# EAGLE design Main (EAGLE 7.2.0)
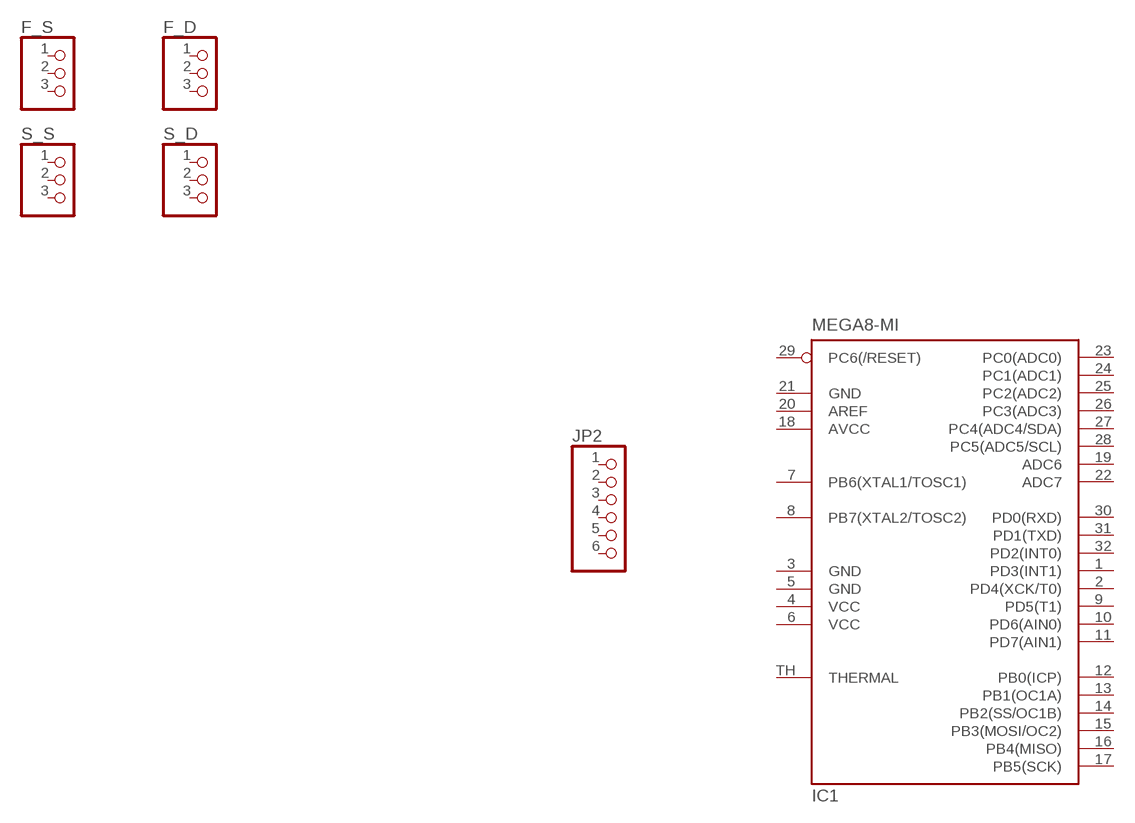
[diagram p0: schematic, sheet 1]

## Parts
F_D  PINHD-1X3  [1X03]
F_S  PINHD-1X3  [1X03]
IC1  MEGA8-MI  [MLF32-TH]
JP2  PINHD-1X6  [1X06]
S_D  PINHD-1X3  [1X03]
S_S  PINHD-1X3  [1X03]
Unconnected: F_D.1 F_D.2 F_D.3 F_S.1 F_S.2 F_S.3 IC1.1(PD3(INT1)) IC1.2(PD4(XCK/T0)) IC1.7(PB6(XTAL1/TOSC1)) IC1.8(PB7(XTAL2/TOSC2)) IC1.9(PD5(T1)) IC1.10(PD6(AIN0)) IC1.11(PD7(AIN1)) IC1.12(PB0(ICP)) IC1.13(PB1(OC1A)) IC1.14(PB2(SS/OC1B)) IC1.15(PB3(MOSI/OC2)) IC1.16(PB4(MISO)) IC1.17(PB5(SCK)) IC1.19(ADC6) IC1.20(AREF) IC1.22(ADC7) IC1.23(PC0(ADC0)) IC1.24(PC1(ADC1)) IC1.25(PC2(ADC2)) IC1.26(PC3(ADC3)) IC1.27(PC4(ADC4/SDA)) IC1.28(PC5(ADC5/SCL)) IC1.29(PC6(/RESET)) IC1.30(PD0(RXD)) IC1.31(PD1(TXD)) IC1.32(PD2(INT0)) IC1.TH(THERMAL) JP2.1 JP2.2 JP2.3 JP2.4 JP2.5 JP2.6 S_D.1 S_D.2 S_D.3 S_S.1 S_S.2 S_S.3

## Power pins joined to a net without a drawn wire
AVCC: IC1.18(AVCC)
GND: IC1.3(GND) IC1.5(GND) IC1.21(GND)
VCC: IC1.4(VCC) IC1.6(VCC)

## Library data of the parts
F_D F_S S_D S_S = pinhead:PINHD-1X3: PIN HEADER
IC1 = atmel:MEGA8-MI: MICROCONTROLLER 8 Kbytes FLASH, 1 kbytes SRAM, 512 bytes EEPROM, USART, 6-channel 10 bit ADC, 2-channel 8 bit ADC Pin compatible with Atmega48, ATMega88, ATMega168 Source: avr.lbr; MPN: ATMEGA88PA-MU; OC_FARNELL: 1715491; OC_NEWARK: 15R0272
JP2 = pinhead:PINHD-1X6: PIN HEADER

## Board
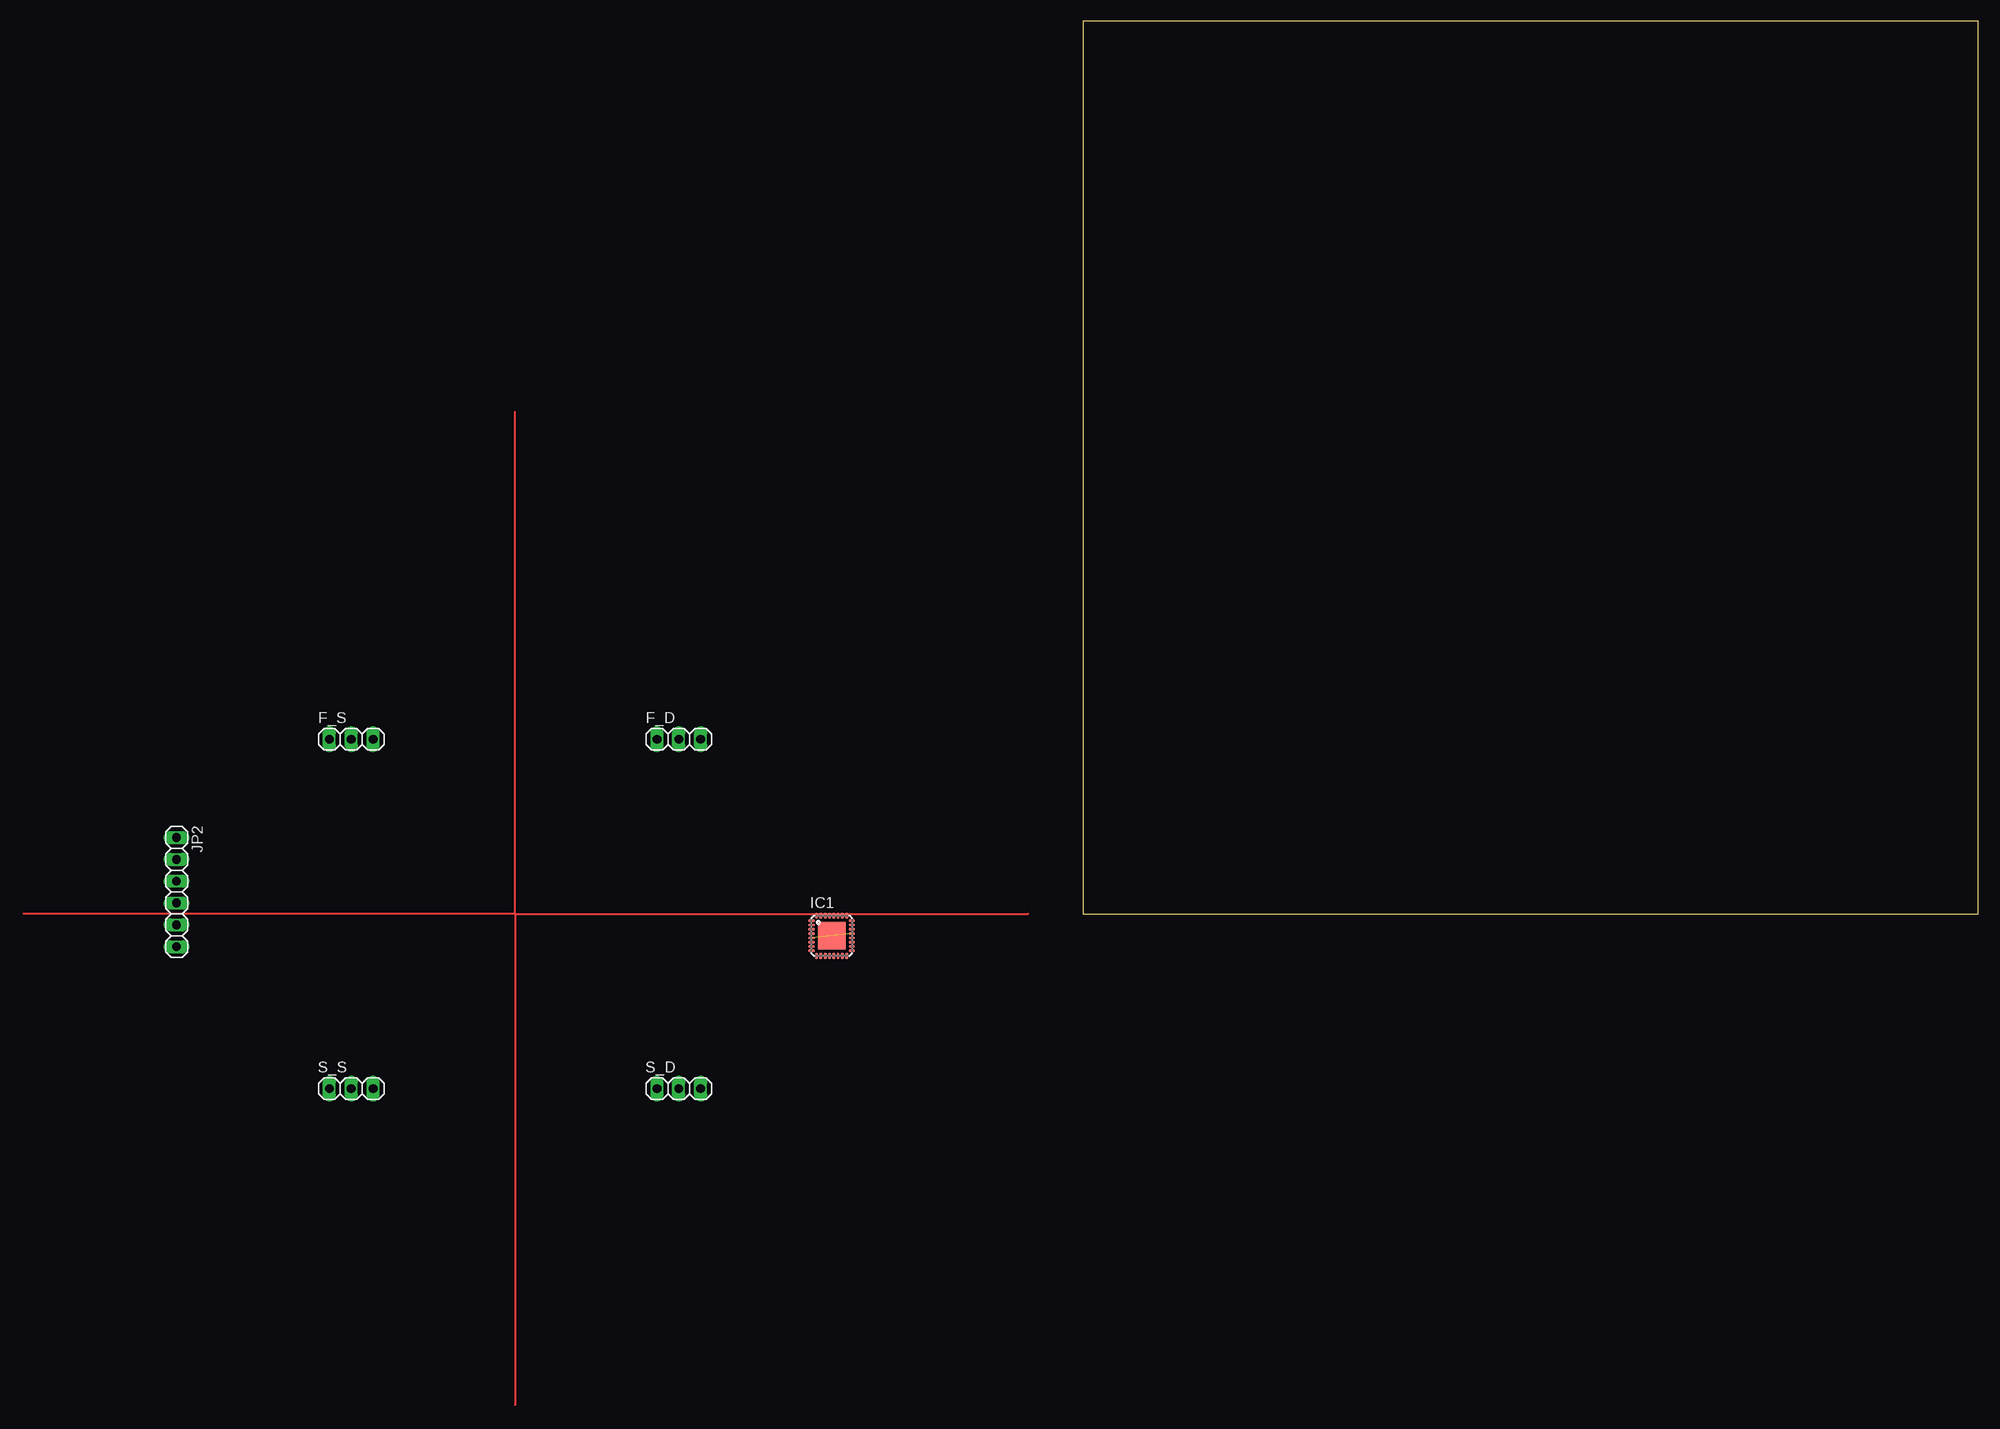
[diagram p1: board, top side]
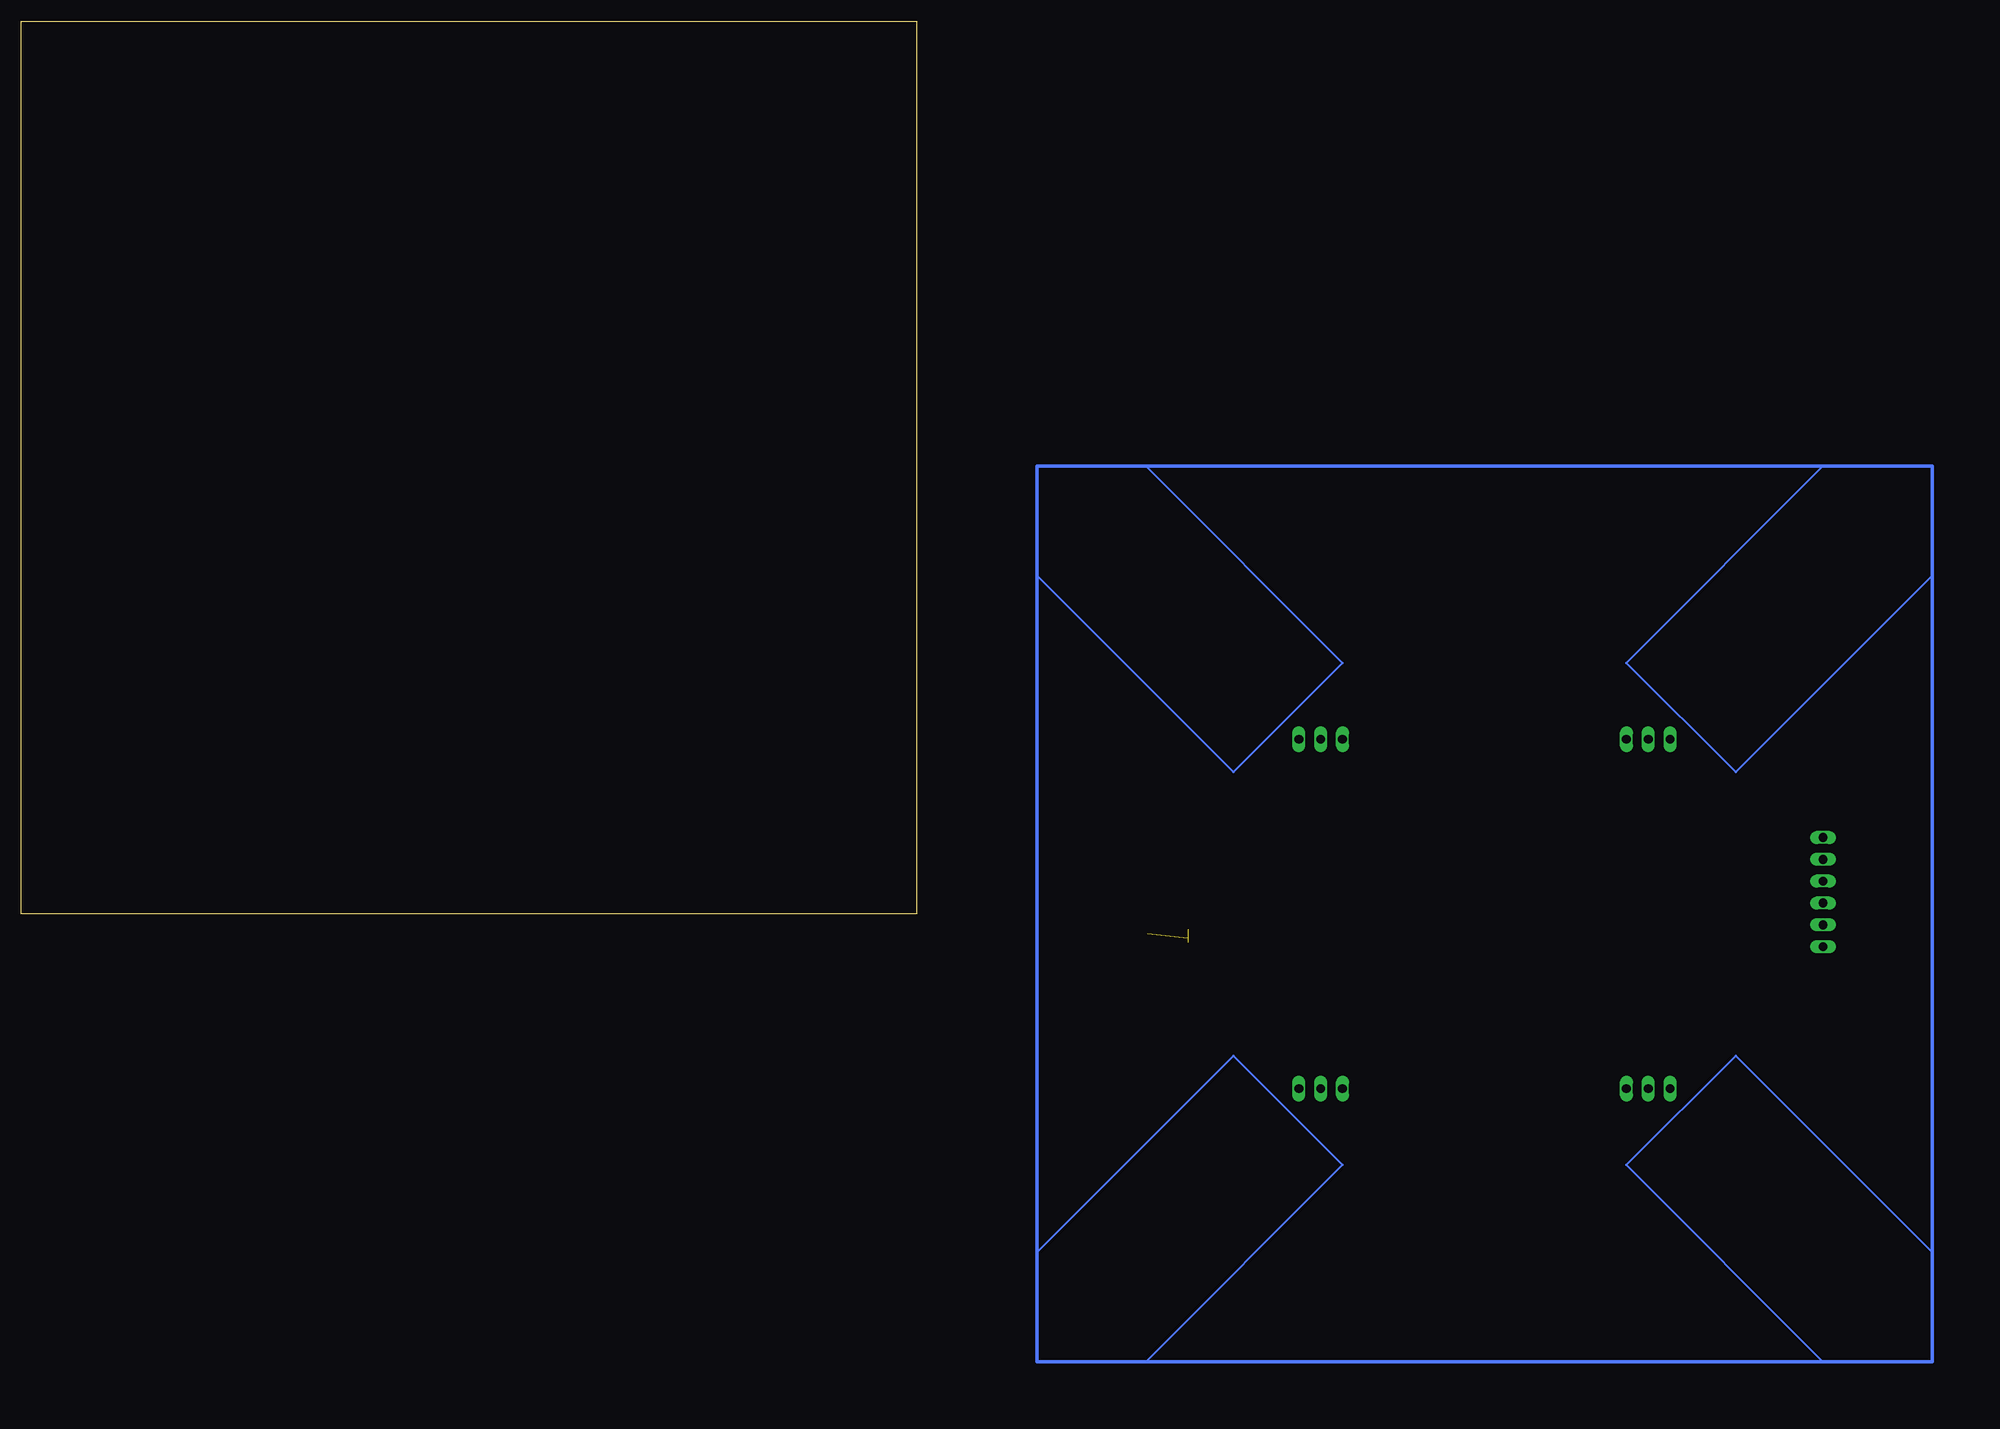
[diagram p2: board, bottom side, seen from below]

Size 104.12 x 103.81 mm. Coordinates in mm from the lower left corner, seen from the top.
Outline: 0,0 104.12,0 104.12,103.81 0,103.81 0,0
Copper layers (1*16): Top 0.035mm / dielectric 1.5mm / Bottom 0.035mm
Design rules "default": minimum track width 10mil, minimum drill 24mil, track to track 8mil, track to pad 8mil, pad to pad 8mil, via to via 8mil, smd to smd 8mil, copper to edge 40mil, drill to drill 8mil, minimum pad ring 10mil, minimum via ring 8mil, stop-mask expansion 4mil, vias tented up to drill 0mil, thermal gap 10mil

### Footprints (pad centres in the part's own frame; a part is rotated, then mirrored left to right if it is on the bottom)
1X03 = drill 1.016 long: 1 -2.54,0; 2 0,0; 3 2.54,0
MLF32-TH = smd 0.7 x 0.3: 1 -2.35,1.75; 2 -2.35,1.25; 3 -2.35,0.75; 4 -2.35,0.25; 5 -2.35,-0.25; 6 -2.35,-0.75; 7 -2.35,-1.25; 8 -2.35,-1.75; 17 2.35,-1.75; 18 2.35,-1.25; 19 2.35,-0.75; 20 2.35,-0.25; 21 2.35,0.25; 22 2.35,0.75; 23 2.35,1.25; 24 2.35,1.75 | smd 0.3 x 0.7: 9 -1.75,-2.35; 10 -1.25,-2.35; 11 -0.75,-2.35; 12 -0.25,-2.35; 13 0.25,-2.35; 14 0.75,-2.35; 15 1.25,-2.35; 16 1.75,-2.35; 25 1.75,2.35; 26 1.25,2.35; 27 0.75,2.35; 28 0.25,2.35; 29 -0.25,2.35; 30 -0.75,2.35; 31 -1.25,2.35; 32 -1.75,2.35 | smd 3.2 x 3.2: TH 0,0
1X06 = drill 1.016 long: 1 -6.35,0; 2 -3.81,0; 3 -1.27,0; 4 1.27,0; 5 3.81,0; 6 6.35,0

### Placement (x,y rotation side)
F_D  -46.99,20.32 0 top  (outside the outline)
F_S  -85.09,20.32 0 top  (outside the outline)
IC1  -29.21,-2.54 0 top  (outside the outline)
JP2  -105.41,2.54 270 top  (outside the outline)
S_D  -46.99,-20.32 0 top  (outside the outline)
S_S  -85.09,-20.32 0 top  (outside the outline)

### Tracks (layer width: path | path; a pad name or v marks a point on that pad's centre or on a via)
GND  (2 unrouted)
N$1
  Bottom 0.305: -13.97,50.8 -13.97,39.37 -36.83,16.51 -49.53,29.21 -26.67,52.07 -13.97,52.07 | -105.41,52.07 -118.11,52.07 -118.11,39.37 -95.25,16.51 -82.55,29.21 -105.41,52.07 | -13.97,-52.07 -26.67,-52.07 -49.53,-29.21 -36.83,-16.51 -13.97,-39.37 -13.97,-52.07
  Bottom 0.406: -13.97,50.8 -13.97,-52.07 -118.11,-52.07 -118.11,52.07 -13.97,52.07 -13.97,50.8
N$2
  Top 0.254: -66.04,0 -66.04,58.42 | -66.04,0 -66.04,-57.15 | -66.04,0 -6.35,0 | -66.04,0 -123.19,0
N$4
  Bottom 0.305: -95.25,-16.51 -82.55,-29.21 -105.41,-52.07 -118.11,-52.07 -118.11,-39.37 -95.25,-16.51
VCC  (1 unrouted)